# EAGLE design trashotron-neuron-v1 (EAGLE 9.6.2)
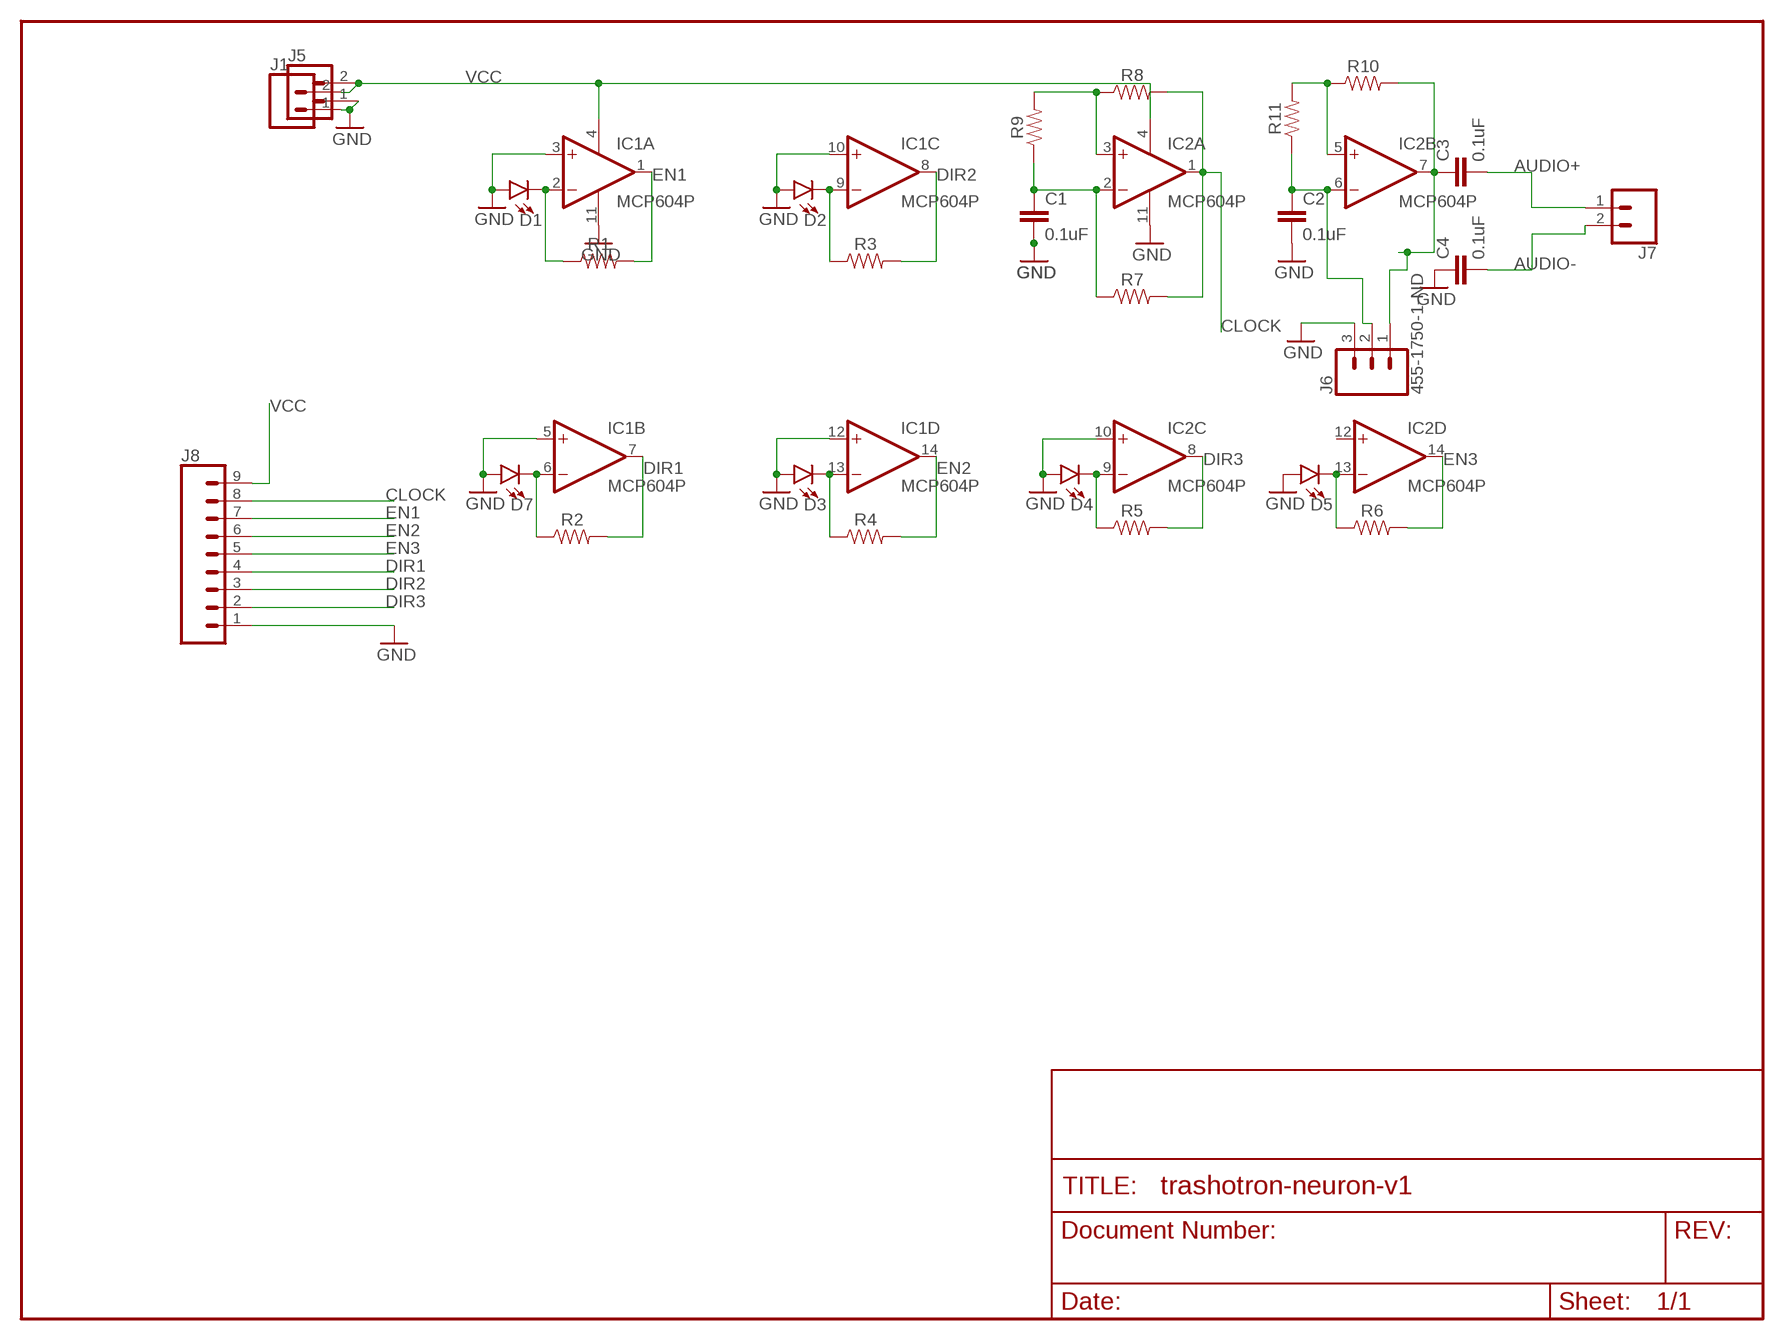
[diagram p0: schematic, sheet 1]

## Parts
C1  0.1uF  0.1UF-KIT-EZ-50V-20%  [CAP-PTH-SMALL-KIT]
C2  0.1uF  0.1UF-KIT-EZ-50V-20%  [CAP-PTH-SMALL-KIT]
C3  0.1uF  0.1UF-KIT-EZ-50V-20%  [CAP-PTH-SMALL-KIT]
C4  0.1uF  0.1UF-KIT-EZ-50V-20%  [CAP-PTH-SMALL-KIT]
D1  LED3MM  [LED_3MM]
D2  LED3MM  [LED_3MM]
D3  LED3MM  [LED_3MM]
D4  LED3MM  [LED_3MM]
D5  LED3MM  [LED_3MM]
D7  LED3MM  [LED_3MM]
IC1  MCP604P  [DIL14]
IC2  MCP604P  [DIL14]
J1  CONN_02  [1X02]
J5  CONN_02  [1X02]
J6  455-1750-1-ND  CONN_03  [1X03]
J7  CONN_02  [1X02]
J8  CONN_09  [1X09]
R1  RESISTORAXIAL-0.3  [AXIAL-0.3]
R2  RESISTORAXIAL-0.3  [AXIAL-0.3]
R3  RESISTORAXIAL-0.3  [AXIAL-0.3]
R4  RESISTORAXIAL-0.3  [AXIAL-0.3]
R5  RESISTORAXIAL-0.3  [AXIAL-0.3]
R6  RESISTORAXIAL-0.3  [AXIAL-0.3]
R7  RESISTORAXIAL-0.3  [AXIAL-0.3]
R8  RESISTORAXIAL-0.3  [AXIAL-0.3]
R9  RESISTORAXIAL-0.3  [AXIAL-0.3]
R10  RESISTORAXIAL-0.3  [AXIAL-0.3]
R11  RESISTORAXIAL-0.3  [AXIAL-0.3]

## Nets
AUDIO+: C3.2 J7.1
AUDIO-: C4.2 J7.2
CLOCK: IC2.1(A:OUT) J8.8 R7.P$2 R8.P$2
DIR1: IC1.7(B:OUT) J8.4 R2.P$2
DIR2: IC1.8(C:OUT) J8.3 R3.P$2
DIR3: IC2.8(C:OUT) J8.2 R5.P$2
EN1: IC1.1(A:OUT) J8.7 R1.P$2
EN2: IC1.14(D:OUT) J8.6 R4.P$2
EN3: IC2.14(D:OUT) J8.5 R6.P$2
GND: C1.2 C2.2 C4.1 D1.A D2.A D3.A D4.A D5.A D7.A IC1.3(A:+IN) IC1.5(B:+IN) IC1.10(C:+IN) IC1.11(P:V-) IC1.12(D:+IN) IC2.10(C:+IN) IC2.11(P:V-) J1.1 J5.1 J6.3 J8.1
N$1: D1.K(C) IC1.2(A:-IN) R1.P$1
N$5: D7.K(C) IC1.6(B:-IN) R2.P$1
N$7: D2.K(C) IC1.9(C:-IN) R3.P$1
N$9: D4.K(C) IC2.9(C:-IN) R5.P$1
N$11: D5.K(C) IC2.13(D:-IN) R6.P$1
N$13: D3.K(C) IC1.13(D:-IN) R4.P$1
N$15: C2.1 IC2.6(B:-IN) J6.2 R11.P$1
N$16: IC2.3(A:+IN) R8.P$1 R9.P$2
N$18: IC2.5(B:+IN) R10.P$1 R11.P$2
N$24: C1.1 IC2.2(A:-IN) R7.P$1 R9.P$1
N$25: C3.1 IC2.7(B:OUT) J6.1 R10.P$2
VCC: IC1.4(P:V+) IC2.4(P:V+) J1.2 J5.2 J8.9
Unconnected: IC2.12(D:+IN)

## Library data of the parts
C1-C4 = SparkFun-Capacitors:0.1UF: 0.1µF ceramic capacitors A capacitor is a passive two-terminal electrical component used to store electrical energy temporarily in an electric field.; PROD_ID: CAP-08370
D1-D5 D7 = SparkFun-LED:LED: LED (Generic) Standard schematic elements and footprints for 5mm, 3mm, 1206, and 0603 sized LEDs. Generic LEDs with no color specified.; PROD_ID: DIO-08794
IC1 IC2 = linear:MCP604: Quad Op Amp 2.7V to 6.0V Single Supply CMOS Source: http://ww1.microchip.com/downloads/en/DeviceDoc/21314g.pdf
J1 J5 J7 = SparkFun-Connectors:CONN_02: Multi connection point. Often used as Generic Header-pin footprint for 0.1 inch spaced/style header connections On any of the 0.1 inch spaced packages, you can populate with these: Break Away Headers - Straight <https://www.sparkfun.com/products/116> (PRT-00116) Break Away Male Headers - Right Angle <https://www.sparkfun.com/products/553> (PRT-00553) Female Headers <https://www.sparkfun.com/products/115> (PRT-00115) Break Away Headers - Machine Pin <https://www.sparkfun.com/products/117> (PRT-00117) Break Away Female Headers - Swiss Machine Pin <https://www.sparkfun.com/products/743> (PRT-00743) For SCREWTERMINALS and SPRING TERMINALS visit here: Screw Terimnals on SparkFun.com <https://www.sparkfun.com/search/results?term=Screw+Terminals> (5mm/3.5mm/2.54mm spacing) This device is also useful as a general connection point to wire up your design to another part of your project. Our various solder wires solder well into these plated through hole pads. Hook-Up Wire - Assortment (Stranded, 22 AWG) <https://www.sparkfun.com/products/11375> (PRT-11375) Hook-Up Wire - Assortment (Solid Core, 22 AWG) <https://www.sparkfun.com/products/11367> (PRT-11367) View the entire wire category on our website here <https://www.sparkfun.com/categories/141> Special notes: Molex polarized connector foot print use with: PRT-08233 with associated crimp pins and housings. 2.54_SCREWTERM for use with PRT-10571. 3.5mm Screw Terminal footprints for PRT-08084 5mm Screw Terminal footprints for use with PRT-08432
J6 = SparkFun-Connectors:CONN_03: Multi connection point. Often used as Generic Header-pin footprint for 0.1 inch spaced/style header connections On any of the 0.1 inch spaced packages, you can populate with these: Break Away Headers - Straight <https://www.sparkfun.com/products/116> (PRT-00116) Break Away Male Headers - Right Angle <https://www.sparkfun.com/products/553> (PRT-00553) Female Headers <https://www.sparkfun.com/products/115> (PRT-00115) Break Away Headers - Machine Pin <https://www.sparkfun.com/products/117> (PRT-00117) Break Away Female Headers - Swiss Machine Pin <https://www.sparkfun.com/products/743> (PRT-00743) Stackable Header - 3 Pin (Female, 0.1") <https://www.sparkfun.com/products/13875> (PRT-13875) For SCREWTERMINALS and SPRING TERMINALS visit here: Screw Terimnals on SparkFun.com <https://www.sparkfun.com/search/results?term=Screw+Terminals> (5mm/3.5mm/2.54mm spacing) This device is also useful as a general connection point to wire up your design to another part of your project. Our various solder wires solder well into these plated through hole pads. Hook-Up Wire - Assortment (Stranded, 22 AWG) <https://www.sparkfun.com/products/11375> (PRT-11375) Hook-Up Wire - Assortment (Solid Core, 22 AWG) <https://www.sparkfun.com/products/11367> (PRT-11367) View the entire wire category on our website here <https://www.sparkfun.com/categories/141> Special notes: Molex polarized connector foot print use with SKU : PRT-08232 with associated crimp pins and housings.; PROD_ID: XXX-00000
J8 = SparkFun-Connectors:CONN_09: Multi connection point. Often used as Generic Header-pin footprint for 0.1 inch spaced/style header connections On any of the 0.1 inch spaced packages, you can populate with these: Break Away Headers - Straight <https://www.sparkfun.com/products/116> (PRT-00116) Break Away Male Headers - Right Angle <https://www.sparkfun.com/products/553> (PRT-00553) Female Headers <https://www.sparkfun.com/products/115> (PRT-00115) Break Away Headers - Machine Pin <https://www.sparkfun.com/products/117> (PRT-00117) Break Away Female Headers - Swiss Machine Pin <https://www.sparkfun.com/products/743> (PRT-00743) For SCREWTERMINALS and SPRING TERMINALS visit here: Screw Terimnals on SparkFun.com <https://www.sparkfun.com/search/results?term=Screw+Terminals> (5mm/3.5mm/2.54mm spacing) This device is also useful as a general connection point to wire up your design to another part of your project. Our various solder wires solder well into these plated through hole pads. Hook-Up Wire - Assortment (Stranded, 22 AWG) <https://www.sparkfun.com/products/11375> (PRT-11375) Hook-Up Wire - Assortment (Solid Core, 22 AWG) <https://www.sparkfun.com/products/11367> (PRT-11367) View the entire wire category on our website here <https://www.sparkfun.com/categories/141> Special notes: Molex polarized connector foot print use with SKU : PRT-08231 with associated crimp pins and housings. 1MM SMD Version SKU: PRT-10208 NOTES ON THE VARIANTS LOCK and LOCK_LONGPADS... This footprint was designed to help hold the alignment of a through-hole component (i.e. 6-pin header) while soldering it into place. You may notice that each hole has been shifted either up or down by 0.005 of an inch from it's more standard position (which is a perfectly straight line). This slight alteration caused the pins (the squares in the middle) to touch the edges of the holes. Because they are alternating, it causes a "brace" to hold the component in place. 0.005 has proven to be the perfect amount of "off-center" position when using our standard breakaway headers. Although looks a little odd when you look at the bare footprint, once you have a header in there, the alteration is very hard to notice. Also,if you push a header all the way into place, it is covered up entirely on the bottom side.
R1-R11 = SparkFun-Resistors:RESISTOR: Generic Resistor Package

## Net classes
0 default: width 0.203 mm
1 vcc: width 0.254 mm

## Board
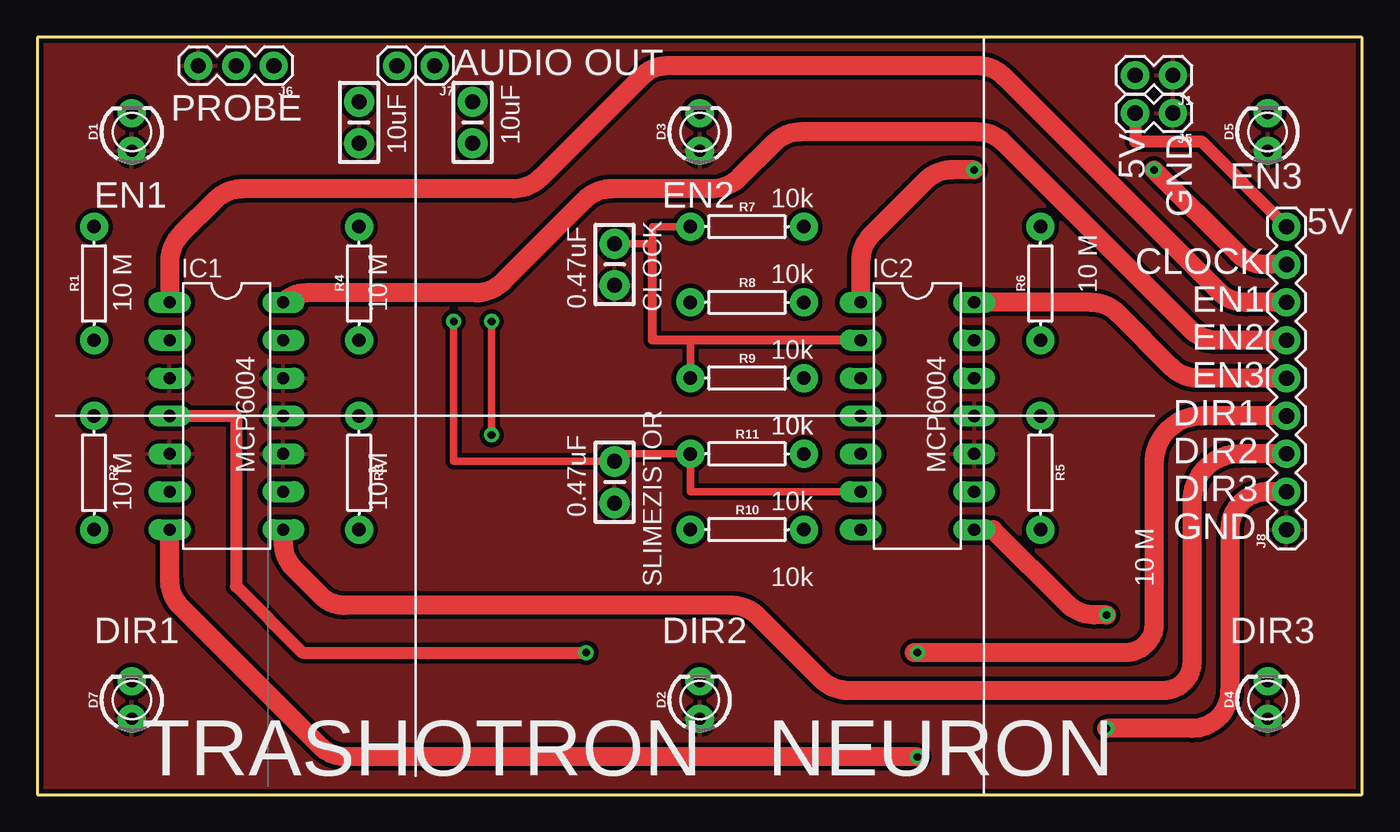
[diagram p1: board, top side]
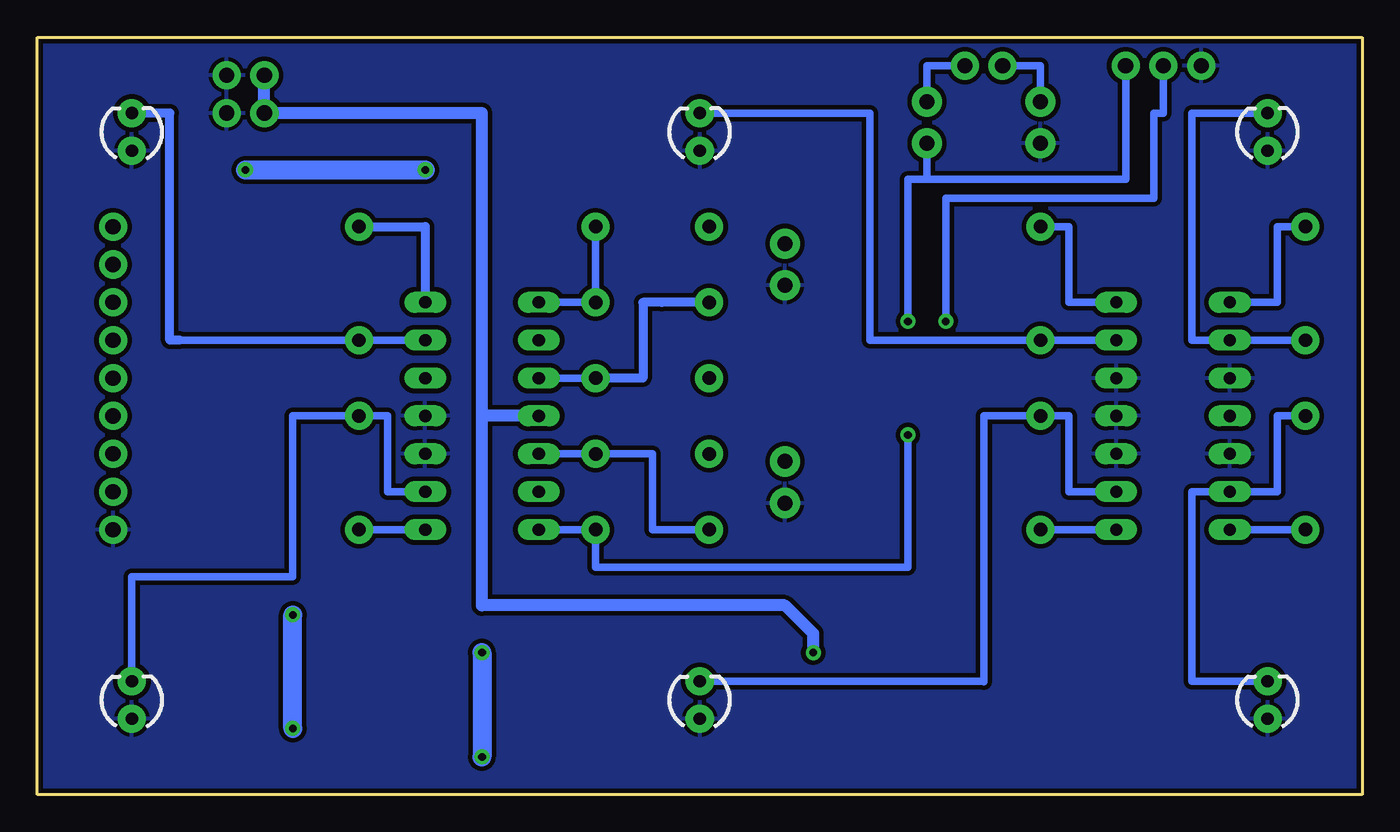
[diagram p2: board, bottom side, seen from below]

Size 88.9 x 50.8 mm. Coordinates in mm from the lower left corner, seen from the top.
Outline: 0,50.8 0,0 88.9,0 88.9,50.8 0,50.8
Copper layers (1*16): Top 0.035mm / dielectric 1.5mm / Bottom 0.035mm
Design rules "default": minimum track width 8mil, minimum drill 20mil, track to track 8mil, track to pad 8mil, pad to pad 8mil, via to via 8mil, smd to smd 8mil, copper to edge 10mil, drill to drill 8mil, minimum pad ring 12mil, minimum via ring 10mil, stop-mask expansion 4mil, vias tented up to drill 25mil, thermal gap 10mil

### Footprints (pad centres in the part's own frame; a part is rotated, then mirrored left to right if it is on the bottom)
CAP-PTH-SMALL-KIT = drill 1.016 pad 2.032: 1 -1.397,0; 2 1.397,0
LED_3MM = drill 0.813 pad 1.88: A -1.27,0; K 1.27,0
DIL14 = drill 0.813 long: 1 -7.62,-3.81; 2 -5.08,-3.81; 3 -2.54,-3.81; 4 0,-3.81; 5 2.54,-3.81; 6 5.08,-3.81; 7 7.62,-3.81; 8 7.62,3.81; 9 5.08,3.81; 10 2.54,3.81; 11 0,3.81; 12 -2.54,3.81; 13 -5.08,3.81; 14 -7.62,3.81
1X02 = drill 1.016 pad 1.88: 1 0,0; 2 2.54,0
1X03 = drill 1.016 pad 1.88: 1 0,0; 2 2.54,0; 3 5.08,0
1X09 = drill 1.016 pad 1.88: 1 0,0; 2 2.54,0; 3 5.08,0; 4 7.62,0; 5 10.16,0; 6 12.7,0; 7 15.24,0; 8 17.78,0; 9 20.32,0
AXIAL-0.3 = drill 0.9 pad 1.88: P$1 -3.81,0; P$2 3.81,0

### Placement (x,y rotation side)
C1  38.73,35.56 270 top
C2  38.73,20.95 270 top
C3  29.21,45.09 90 top
C4  21.59,45.09 90 top
D1  6.35,44.45 90 top
D2  44.45,6.35 90 top
D3  44.45,44.45 90 top
D4  82.55,6.35 90 top
D5  82.55,44.45 90 top
D7  6.35,6.35 90 top
IC1  12.7,25.4 270 top
IC2  59.05,25.4 270 top
J1  76.2,48.26 180 top
J5  76.2,45.72 180 top
J6  15.88,48.9 180 top
J7  26.67,48.9 180 top
J8  83.82,17.78 90 top
R1  3.81,34.29 90 top
R2  3.81,21.59 270 top
R3  21.59,21.59 270 top
R4  21.59,34.29 90 top
R5  67.31,21.59 270 top
R6  67.31,34.29 90 top
R7  47.62,38.1 0 top
R8  47.62,33.02 0 top
R9  47.62,27.94 0 top
R10  47.62,17.78 0 top
R11  47.62,22.86 0 top

### Tracks (layer width: path | path; a pad name or v marks a point on that pad's centre or on a via)
AUDIO+
  Bottom 0.508: J7.1 29.21,48.9 C3.2
AUDIO-
  Bottom 0.508: J7.2 21.59,48.9 C4.2
CLOCK  (via drill 0.51)
  Top 1.27: J8.8 82.33,35.56 arc-45 80.54,36.3 v74.93,41.91 | v62.87,41.91 61.38,41.91 arc45 59.58,41.17 55.99,37.57 arc45 55.24,35.78 IC2.1
  Bottom 0.508: IC2.1 R8.P$2 R7.P$2
  Bottom 1.27: v74.93,41.91 v62.87,41.91
DIR1  (via drill 0.51)
  Top 1.27: J8.4 78.11,25.4 arc90 74.93,22.23 74.93,11.43 arc-90 73.03,9.53 v59.05,9.53 58.84,9.53 | v59.05,2.54 20.74,2.54 arc-45 18.94,3.28 9.63,12.59 arc-45 8.89,14.39 IC1.7
  Bottom 0.508: IC1.7 R2.P$2
  Bottom 1.27: v59.05,9.53 v59.05,2.54
DIR2
  Top 1.27: J8.3 80.64,22.86 arc90 77.47,19.68 77.47,8.89 arc-90 75.56,6.99 54.39,6.99 arc-45 52.6,7.73 48.37,11.96 arc45 46.57,12.7 20.58,12.7 arc-45 19.05,13.34 17.25,15.13 arc-45 16.51,16.93 IC1.8
  Bottom 0.508: IC1.8 R3.P$2
DIR3  (via drill 0.51)
  Top 1.27: J8.2 82.55,20.32 arc90 80.01,17.78 80.01,6.99 arc-90 77.47,4.45 v71.75,4.45 | v71.75,12.06 70.9,12.06 arc-45 69.11,12.81 64.14,17.78 IC2.8
  Bottom 0.508: IC2.8 R5.P$2
  Bottom 1.27: v71.75,4.45 v71.75,12.06
EN1
  Top 1.27: J8.7 81.06,33.02 arc-45 79.27,33.76 64.88,48.15 arc45 63.08,48.9 42.33,48.9 arc45 40.53,48.15 33.76,41.38 arc-45 31.97,40.64 13.75,40.64 arc45 11.96,39.9 9.63,37.57 arc45 8.89,35.78 IC1.1
  Bottom 0.508: IC1.1 5.71,33.02 5.71,38.1 R1.P$2
EN2
  Top 1.27: J8.6 79.16,30.48 arc-45 77.36,31.22 64.88,43.71 arc45 63.08,44.45 51.22,44.45 arc45 49.42,43.71 47.1,41.38 arc-45 45.3,40.64 38.52,40.64 arc45 36.72,39.9 31.22,34.4 arc-45 29.43,33.66 18.04,33.66 arc45 IC1.14
  Bottom 0.508: IC1.14 19.68,33.02 19.68,38.1 R4.P$2
EN3
  Top 1.27: J8.5 77.89,27.94 arc-45 76.09,28.68 72.5,32.28 arc45 70.7,33.02 IC2.14
  Bottom 0.61: R6.P$2 62.87,38.1 IC2.14
GND
  pour Top (isolate 0.305): 0,50.8 88.9,50.8 88.9,0 0,0
  pour Bottom (isolate 0.305): 0,50.8 88.9,50.8 88.9,0 0,0
N$1
  Bottom 0.508: R1.P$1 IC1.2 11.43,30.48 11.43,45.72 D1.K
N$5
  Bottom 0.508: R2.P$1 5.71,25.4 5.71,20.32 IC1.6 11.43,20.32 11.43,7.62 D7.K
N$7
  Bottom 0.508: IC1.9 19.68,20.32 19.68,25.4 R3.P$1 25.4,25.4 25.4,7.58 25.72,7.62 D2.K
N$9
  Bottom 0.508: D4.K 82.55,14.61 71.75,14.61 71.75,25.4 R5.P$1 65.41,25.4 65.41,20.32 IC2.9
N$11
  Bottom 0.508: 79.38,30.48 R6.P$1 IC2.13
  Bottom 0.61: 81.92,45.72 D5.K 80.01,45.72 80.01,30.48 79.38,30.48
N$13
  Bottom 0.508: IC1.13 R4.P$1 33.02,30.48 33.02,45.72 D3.K
N$15  (via drill 0.51)
  Top 0.508: IC2.6 43.81,20.32 R11.P$1 38.73,22.86 C2.1 27.94,22.35 v27.94,31.75
  Bottom 0.508: v27.94,31.75 27.94,40.01 13.97,40.01 13.97,45.72 13.34,45.72 J6.2
N$16
  Bottom 0.508: IC2.3 R9.P$2
  Bottom 0.61: R8.P$1 46.99,33.02 48.26,33.02 48.26,27.94 R9.P$2
N$18
  Bottom 0.508: IC2.5 R11.P$2 47.62,22.86 47.62,17.78 R10.P$1
N$24
  Top 0.508: R9.P$1 43.81,30.48 | C1.1 41.27,36.96 41.27,38.1 R7.P$1
  Top 0.61: IC2.2 43.81,30.48 41.27,30.48 41.27,36.96
N$25  (via drill 0.51)
  Top 0.508: v30.48,31.75 v30.48,24.13
  Bottom 0.508: IC2.7 R10.P$2 51.44,15.24 30.48,15.24 v30.48,24.13 | J6.1 15.88,41.27 29.21,41.27 | 29.21,41.27 C3.1 | 29.21,41.27 30.48,41.27 v30.48,31.75
VCC  (via drill 0.51)
  Top 0.813: J5.2 73.66,43.81 78.11,43.81 J8.9 | IC1.4 13.34,25.4 13.34,13.97 17.78,9.53 v36.83,9.53
  Bottom 0.813: 59.05,25.4 59.05,45.72 J5.2 J1.2 | IC2.4 59.05,25.4 | v36.83,9.53 36.83,10.79 38.73,12.7 59.05,12.7 59.05,25.4

### Text on the board
tPlace: AUDIO OUT | 10uF | PROBE | 10uF | 10k | 5V | EN3 | EN1 | EN2 | GND | 5V | 0.47uF | 10k | CLOCK | 10 M | 10 M | 10 M | CLOCK | EN1 | 10k | EN2 | EN3 | 10k | 10k | DIR1 | 0.47uF | MCP6004 | MCP6004 | DIR2 | 10k | DIR3 | 10 M | 10 M | GND | 10k | SLIMEZISTOR | 10 M | DIR1 | DIR2 | DIR3 | TRASHOTRON NEURON
tValues: Tent Vias! | Arduino Wee v1.3